# EAGLE design 9KeyRGB (EAGLE 8.6.1)
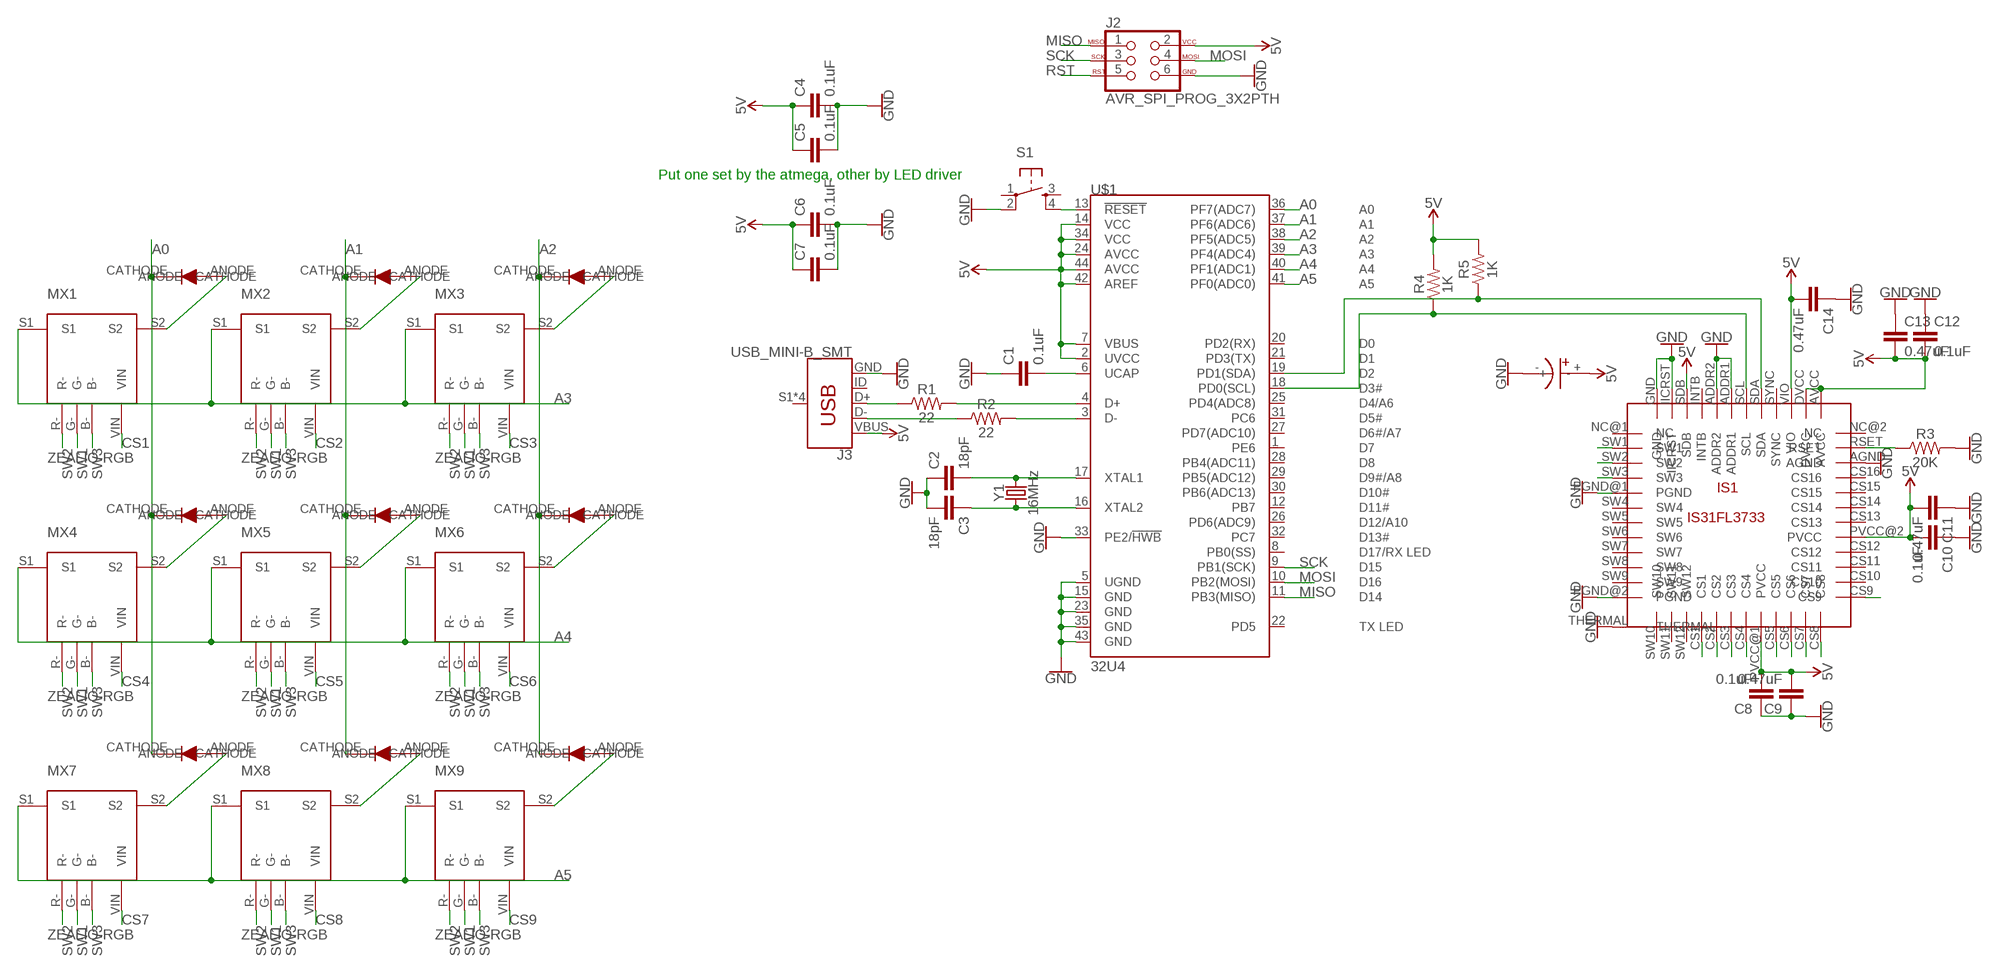
[diagram p0: schematic, sheet 1]

## Parts
C1  0.1uF  0.1UF-0603-25V-5%  [0603]
C2  18pF  0.18UF-0603-10V-10%  [0603]
C3  18pF  0.18UF-0603-10V-10%  [0603]
C4  0.1uF  0.1UF-0603-25V-5%  [0603]
C5  0.1uF  0.1UF-0603-25V-5%  [0603]
C6  0.1uF  0.1UF-0603-25V-5%  [0603]
C7  0.1uF  0.1UF-0603-25V-5%  [0603]
C8  0.1uF  0.1UF-0603-25V-5%  [0603]
C9  0.47uF  0.1UF-0603-25V-5%  [0603]
C10  0.1uF  0.1UF-0603-25V-5%  [0603]
C11  0.47uF  0.1UF-0603-25V-5%  [0603]
C12  0.1uF  0.1UF-0603-25V-5%  [0603]
C13  0.47uF  0.1UF-0603-25V-5%  [0603]
C14  0.47uF  0.1UF-0603-25V-5%  [0603]
D1  BAS16L  [BAS16L]
D2  BAS16L  [BAS16L]
D3  BAS16L  [BAS16L]
D4  BAS16L  [BAS16L]
D5  BAS16L  [BAS16L]
D6  BAS16L  [BAS16L]
D7  BAS16L  [BAS16L]
D8  BAS16L  [BAS16L]
D9  BAS16L  [BAS16L]
IS1  IS31FL3733  [IS31FL3733]
J2  AVR_SPI_PROG_3X2PTH  [2X3]
J3  USB_MINI-B_SMT  [USB-MINIB]
MX1  ZEALIO-RGB  [ZEALIO-RGB]
MX2  ZEALIO-RGB  [ZEALIO-RGB]
MX3  ZEALIO-RGB  [ZEALIO-RGB]
MX4  ZEALIO-RGB  [ZEALIO-RGB]
MX5  ZEALIO-RGB  [ZEALIO-RGB]
MX6  ZEALIO-RGB  [ZEALIO-RGB]
MX7  ZEALIO-RGB  [ZEALIO-RGB]
MX8  ZEALIO-RGB  [ZEALIO-RGB]
MX9  ZEALIO-RGB  [ZEALIO-RGB]
R1  22  0.05OHM-0603-1/5W-1%  [0603]
R2  22  0.05OHM-0603-1/5W-1%  [0603]
R3  20K  0.05OHM-0603-1/5W-1%  [0603]
R4  1K  0.05OHM-0603-1/5W-1%  [0603]
R5  1K  0.05OHM-0603-1/5W-1%  [0603]
S1  TAC_SWITCHPTH  [TACTILE-PTH]
U$1  32U4  ATMEGA32U4TQFP-44  [TQFP44]
U$2  EEA-FC1A220  [EEA-FC1A220]
Y1  16MHz  CRYSTAL-16MHZPTH-HC49US  [HC49US]

## Nets
5V: C4.1 C5.1 C6.1 C7.1 C8.2 C9.2 C10.2 C11.2 C12.2 C13.2 C14.2 IS1.AVCC IS1.DVCC IS1.PVCC@1(PVCC) IS1.PVCC@2(PVCC) IS1.SDB IS1.VIO J2.2 J3.VBUS R4.2 R5.2 U$1.2(UVCC) U$1.7(VBUS) U$1.14(VCC) U$1.24(AVCC) U$1.34(VCC) U$1.42(AREF) U$1.44(AVCC) U$2.+
A0: D1.CATHODE D4.CATHODE D7.CATHODE U$1.36(PF7(ADC7))
A1: D2.CATHODE D5.CATHODE D8.CATHODE U$1.37(PF6(ADC6))
A2: D3.CATHODE D6.CATHODE D9.CATHODE U$1.38(PF5(ADC5))
A3: MX1.S1 MX2.S1 MX3.S1 U$1.39(PF4(ADC4))
A4: MX4.S1 MX5.S1 MX6.S1 U$1.40(PF1(ADC1))
A5: MX7.S1 MX8.S1 MX9.S1 U$1.41(PF0(ADC0))
CS1: IS1.CS1 MX1.VIN
CS2: IS1.CS2 MX2.VIN
CS3: IS1.CS3 MX3.VIN
CS4: IS1.CS4 MX4.VIN
CS5: IS1.CS5 MX5.VIN
CS6: IS1.CS6 MX6.VIN
CS7: IS1.CS7 MX7.VIN
CS8: IS1.CS8 MX8.VIN
CS9: IS1.CS9 MX9.VIN
GND: C1.1 C2.1 C3.2 C4.2 C5.2 C6.2 C7.2 C8.1 C9.1 C10.1 C11.1 C12.1 C13.1 C14.1 IS1.ADDR1 IS1.ADDR2 IS1.AGND IS1.GND IS1.IICRST IS1.PGND@1(PGND) IS1.PGND@2(PGND) IS1.THERMAL J2.6 J3.GND R3.2 S1.2 U$1.5(UGND) U$1.15(GND) U$1.23(GND) U$1.33(PE2/!HWB) U$1.35(GND) U$1.43(GND) U$2.-
MISO: J2.1 U$1.11(PB3(MISO))
MOSI: J2.4 U$1.10(PB2(MOSI))
N$1: D1.ANODE MX1.S2
N$2: D2.ANODE MX2.S2
N$3: D3.ANODE MX3.S2
N$4: D4.ANODE MX4.S2
N$5: D5.ANODE MX5.S2
N$6: D6.ANODE MX6.S2
N$7: D7.ANODE MX7.S2
N$8: D8.ANODE MX8.S2
N$9: D9.ANODE MX9.S2
N$16: IS1.SDA R5.1 U$1.19(PD1(SDA))
N$17: C1.2 U$1.6(UCAP)
N$18: J3.D+ R1.1
N$19: R1.2 U$1.4(D+)
N$20: J3.D- R2.1
N$21: R2.2 U$1.3(D-)
N$22: C2.2 U$1.17(XTAL1) Y1.2
N$23: C3.1 U$1.16(XTAL2) Y1.1
N$24: IS1.SCL R4.1 U$1.18(PD0(SCL))
N$27: IS1.RSET R3.1
RST: J2.5 S1.4 U$1.13(!RESET)
SCK: J2.3 U$1.9(PB1(SCK))
SW1: IS1.SW1 MX1.G- MX2.G- MX3.G- MX4.G- MX5.G- MX6.G- MX7.G- MX8.G- MX9.G-
SW2: IS1.SW2 MX1.R- MX2.R- MX3.R- MX4.R- MX5.R- MX6.R- MX7.R- MX8.R- MX9.R-
SW3: IS1.SW3 MX1.B- MX2.B- MX3.B- MX4.B- MX5.B- MX6.B- MX7.B- MX8.B- MX9.B-
Unconnected: IS1.CS10 IS1.CS11 IS1.CS12 IS1.CS13 IS1.CS14 IS1.CS15 IS1.CS16 IS1.INTB IS1.NC@1(NC) IS1.NC@2(NC) IS1.SW4 IS1.SW5 IS1.SW6 IS1.SW7 IS1.SW8 IS1.SW9 IS1.SW10 IS1.SW11 IS1.SW12 IS1.SYNC J3.ID J3.S1(SHIELD) J3.S2(SHIELD) J3.S3(SHIELD) J3.S4(SHIELD) S1.1 S1.3 U$1.1(PE6) U$1.8(PB0(SS)) U$1.12(PB7) U$1.20(PD2(RX)) U$1.21(PD3(TX)) U$1.22(PD5) U$1.25(PD4(ADC8)) U$1.26(PD6(ADC9)) U$1.27(PD7(ADC10)) U$1.28(PB4(ADC11)) U$1.29(PB5(ADC12)) U$1.30(PB6(ADC13)) U$1.31(PC6) U$1.32(PC7)

## Notes on the sheet
- Put one set by the atmega, other by LED driver

## Library data of the parts
C1 C4-C8 C10 C12 = SparkFun-Capacitors:0.1UF: 0.1µF ceramic capacitors A capacitor is a passive two-terminal electrical component used to store electrical energy temporarily in an electric field.; PROD_ID: CAP-08604
C2 C3 = SparkFun-Capacitors:0.18UF: 0.18µF ceramic capacitor A capacitor is a passive two-terminal electrical component used to store electrical energy temporarily in an electric field.; PROD_ID: CAP-12380; VALUE: 0.18uF
C9 C11 C13 C14 = SparkFun-Capacitors:0.1UF: 0.1µF ceramic capacitors A capacitor is a passive two-terminal electrical component used to store electrical energy temporarily in an electric field.; PROD_ID: CAP-08604; VALUE: 0.1uF
D1-D9 = Ben's Parts:BAS16L
IS1 = Ben's Parts:IS31FL3733
J2 = SparkFun-Connectors:AVR_SPI_PROG_3X2: AVR ISP 6 Pin This is the reduced ISP connector for AVR programming. Common on Arduino. This footprint will take up less PCB space and can be used with a 10-pin to 6-pin adapter such as SKU: BOB-08508 **Special note about "TEST_POINT" package. The stop mask is on the top side, so if you want your programming test points to be on the bottom of your board, make sure to place this package on the bottom side of the board. This also ensure that the orientation to program from the bottom side will be correct. SparkFun Products: SparkFun ISP Pogo Adapter <https://www.sparkfun.com/products/11591> - NS Tiny AVR Programmer <https://www.sparkfun.com/products/11801> -PTH
J3 = SparkFun-Connectors:USB_MINI-B: USB type Mini-B Connector Breaks out 5th pin, and includes shield pins if needed. SparkFun Products: SparkFun FTDI Basic Breakout <https://www.sparkfun.com/products/9716> SparkFun XBee Explorer USB <https://www.sparkfun.com/products/11812> SparkFun Redboard <https://www.sparkfun.com/products/12757>; PROD_ID: CONN-08193; SF_ID: PRT-00587
MX1-MX9 = Ben's Parts:ZEALIO-RGB
R1-R5 = SparkFun-Resistors:0.05OHM: 0.05Ω resistor A resistor is a passive two-terminal electrical component that implements electrical resistance as a circuit element. Resistors act to reduce current flow, and, at the same time, act to lower voltage levels within circuits. - Wikipedia; PROD_ID: RES-12535; VALUE: 0.05
S1 = SparkFun-Retired:TAC_SWITCH: Momentary Switch Button commonly used for reset or general input. Spark Fun Electronics SKU : COM-00097 SMT- SWCH-08247
U$1 = SparkFun-IC-Microcontroller:ATMEGA32U4: Atmel MCU, 32KByte Atmel 44-pin 8-bit Microcontroller with 32KBytes of ISP Flash and USB Controller Datasheet <http://cdn.sparkfun.com/datasheets/Dev/Arduino/Boards/ATMega32U4.pdf> SparkFun Products LilyPad Arduino USB - ATmega32U4 Board <https://www.sparkfun.com/products/12049> (DEV-12049) Pro Micro - 5V/16MHz <https://www.sparkfun.com/products/12640> (DEV-12640) Pro Micro - 3.3V/8MHz <https://www.sparkfun.com/products/12587> (DEV-12587) Fio v3 - ATmega32U4 <https://www.sparkfun.com/products/11520> (DEV-11520) Qduino Mini <https://www.sparkfun.com/products/13614> (DEV-13614) Makey Makey - Standard Kit <https://www.sparkfun.com/products/11511> (WIG-11511) Makey Makey Deluxe Kit <https://www.sparkfun.com/products/11519> (WIG-11519); PROD_ID: IC-11161
U$2 = Ben's Parts:EEA-FC1A220
Y1 = SparkFun-Clocks:CRYSTAL-16MHZ: 16MHz Crystal Digikey Example <http://www.digikey.com/product-search/en?keywords=535-9122-1-ND> Frequency: 16MHz Frequency Stability: ±50ppm Frequency Tolerance: ±20ppm Load Capacitance: 18pF SparkFun Products: Pro Micro -5V/16MHz <https://www.sparkfun.com/products/12640> SparkFun Serial Enabled LCD Kit <https://www.sparkfun.com/products/10097>; PROD_ID: XTAL-08181; SF_ID: COM-00536

## Board
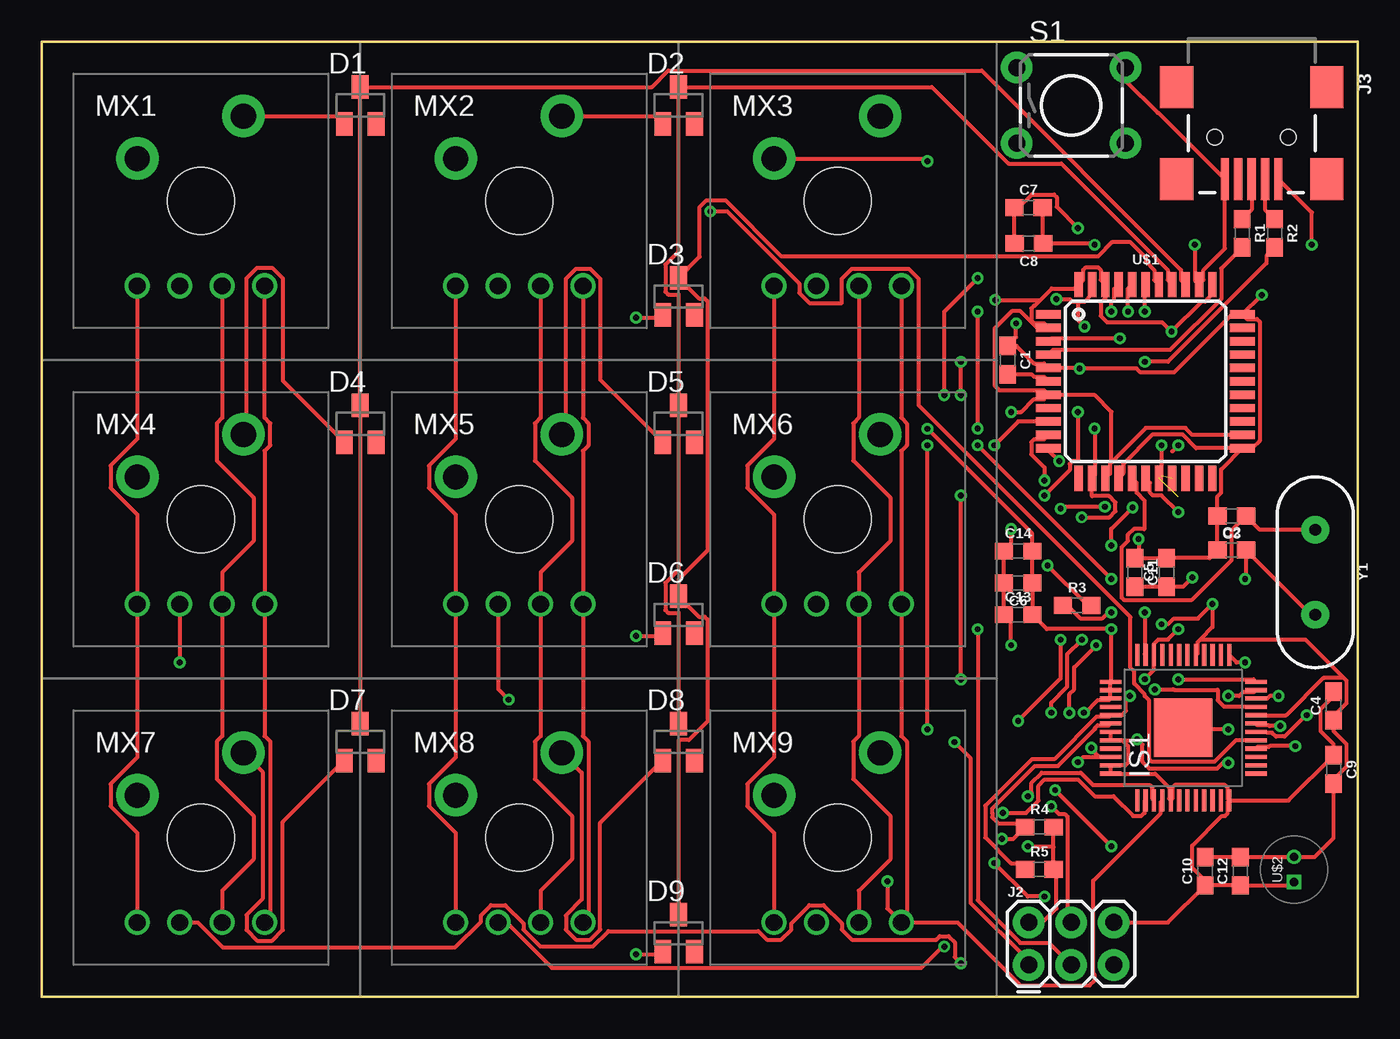
[diagram p1: board, top side]
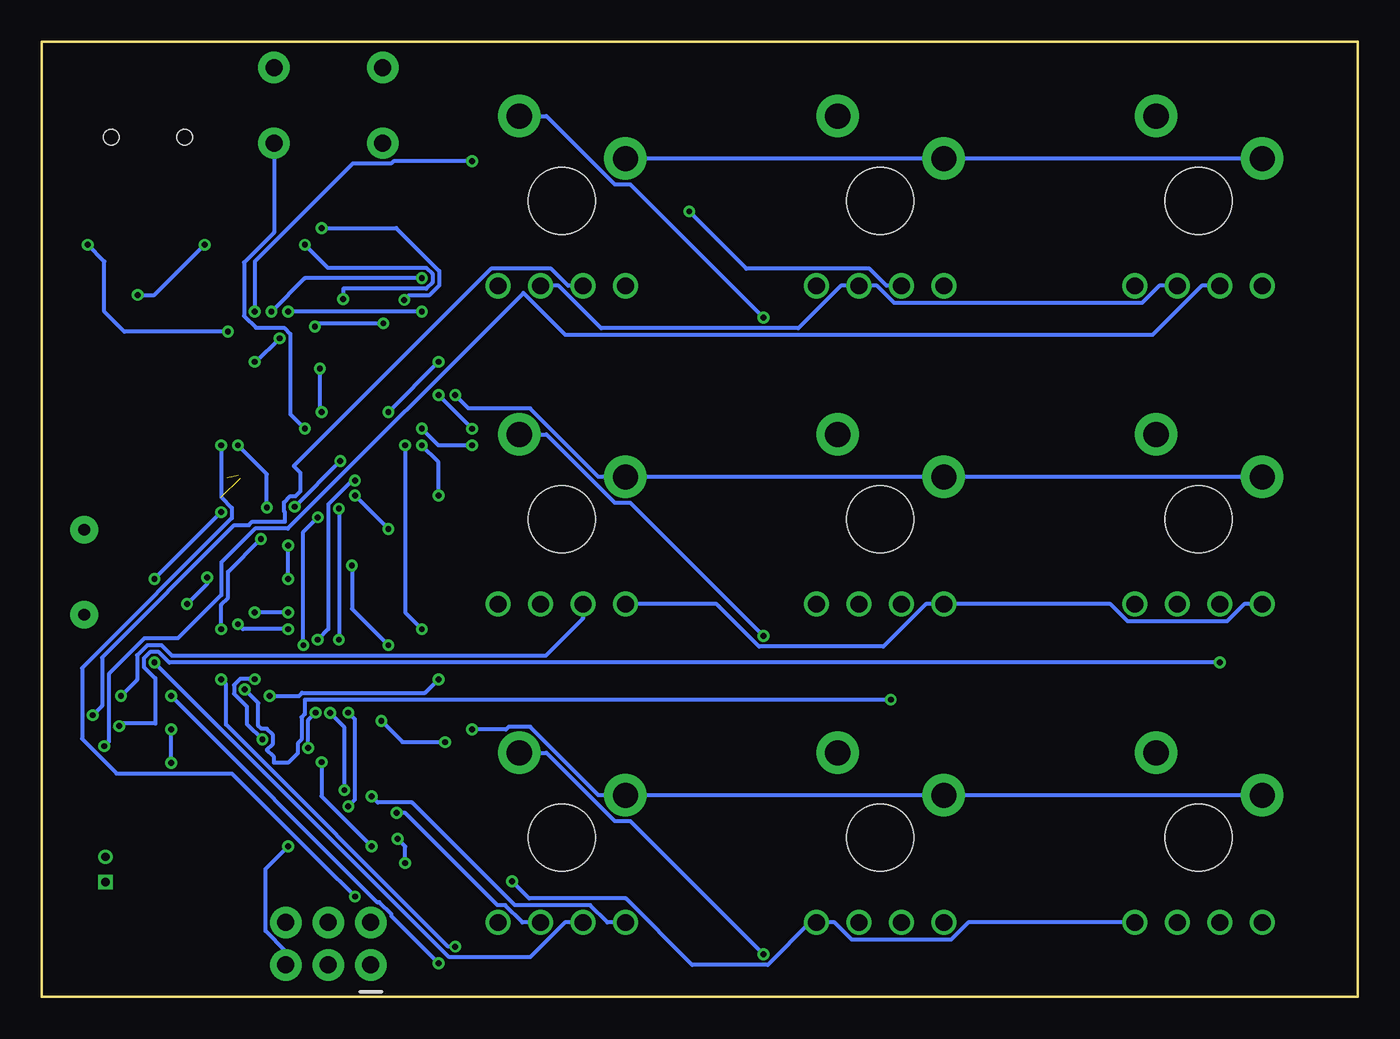
[diagram p2: board, bottom side, seen from below]

Size 78.74 x 57.15 mm. Coordinates in mm from the lower left corner, seen from the top.
Outline: 0,57.15 78.74,57.15 78.74,0 0,0 0,57.15
Copper layers (1*16): Top 0.0356mm / dielectric 1.5011mm / Bottom 0.0356mm
Design rules "oshpark-2layer *": minimum track width 6mil, minimum drill 13mil, track to track 6mil, track to pad 6mil, pad to pad 6mil, via to via 6mil, smd to smd 6mil, copper to edge 15mil, drill to drill 6mil, minimum pad ring 7mil, minimum via ring 7mil, stop-mask expansion 2.5mil, vias tented up to drill 1mm, thermal gap 10mil

### Footprints (pad centres in the part's own frame; a part is rotated, then mirrored left to right if it is on the bottom)
0603 = smd 1.1 x 1: 1 -0.85,0; 2 0.85,0
BAS16L = smd 1 x 1.4: ANODE 0.955,2.075; CATHODE 1.905,4.275; NC 2.855,2.075
IS31FL3733 = smd 0.25 x 1.3: ADDR1 -0.25,4.35; ADDR2 -0.75,4.35; AVCC 2.75,4.35; CS1 -1.25,-4.35; CS2 -0.75,-4.35; CS3 -0.25,-4.35; CS4 0.25,-4.35; CS5 1.25,-4.35; CS6 1.75,-4.35; CS7 2.25,-4.35; CS8 2.75,-4.35; DVCC 2.25,4.35; GND -2.75,4.35; IICRST -2.25,4.35; INTB -1.25,4.35; PVCC@1 0.75,-4.35; SCL 0.25,4.35; SDA 0.75,4.35; SDB -1.75,4.35; SW10 -2.75,-4.35; SW11 -2.25,-4.35; SW12 -1.75,-4.35; SYNC 1.25,4.35; VIO 1.75,4.35 | smd 1.3 x 0.25: AGND 4.35,1.75; CS9 4.35,-2.75; CS10 4.35,-2.25; CS11 4.35,-1.75; CS12 4.35,-1.25; CS13 4.35,-0.25; CS14 4.35,0.25; CS15 4.35,0.75; CS16 4.35,1.25; NC@1 -4.35,2.75; NC@2 4.35,2.75; PGND@1 -4.35,0.75; PGND@2 -4.35,-2.75; PVCC@2 4.35,-0.75; RSET 4.35,2.25; SW1 -4.35,2.25; SW2 -4.35,1.75; SW3 -4.35,1.25; SW4 -4.35,0.25; SW5 -4.35,-0.25; SW6 -4.35,-0.75; SW7 -4.35,-1.25; SW8 -4.35,-1.75; SW9 -4.35,-2.25 | smd 3.5 x 3.5: THERMAL 0,0
2X3 = drill 1.016 pad 1.88: 1 0,0; 2 0,2.54; 3 2.54,0; 4 2.54,2.54; 5 5.08,0; 6 5.08,2.54
USB-MINIB = smd 2.5 x 0.5: D+ 2.5,0; D- 2.5,0.8; GND 2.5,-1.6; ID 2.5,-0.8; VBUS 2.5,1.6 | smd 2.5 x 2: S1 -3,4.5; S2 2.5,4.5; S3 -3,-4.5; S4 2.5,-4.5 | hole 0.9: 0,2.2; 0,-2.2
ZEALIO-RGB = drill 1: B- 3.81,-5.08; G- 1.27,-5.08; R- -3.81,-5.08; VIN -1.27,-5.08 | drill 1.5 pad 2.54: S1 -3.81,2.54; S2 2.54,5.08 | hole 4: 0,0
TACTILE-PTH = drill 1.016 pad 1.88: 1 -3.251,2.261; 2 3.251,2.261; 3 -3.251,-2.261; 4 3.251,-2.261
TQFP44 = smd 1.5 x 0.5: 1 -5.8,4; 2 -5.8,3.2; 3 -5.8,2.4; 4 -5.8,1.6; 5 -5.8,0.8; 6 -5.8,0; 7 -5.8,-0.8; 8 -5.8,-1.6; 9 -5.8,-2.4; 10 -5.8,-3.2; 11 -5.8,-4; 23 5.8,-4; 24 5.8,-3.2; 25 5.8,-2.4; 26 5.8,-1.6; 27 5.8,-0.8; 28 5.8,0; 29 5.8,0.8; 30 5.8,1.6; 31 5.8,2.4; 32 5.8,3.2; 33 5.8,4 | smd 0.5 x 1.5: 12 -4,-5.8; 13 -3.2,-5.8; 14 -2.4,-5.8; 15 -1.6,-5.8; 16 -0.8,-5.8; 17 0,-5.8; 18 0.8,-5.8; 19 1.6,-5.8; 20 2.4,-5.8; 21 3.2,-5.8; 22 4,-5.8; 34 4,5.8; 35 3.2,5.8; 36 2.4,5.8; 37 1.6,5.8; 38 0.8,5.8; 39 0,5.8; 40 -0.8,5.8; 41 -1.6,5.8; 42 -2.4,5.8; 43 -3.2,5.8; 44 -4,5.8
EEA-FC1A220 = drill 0.5: + 0.75,0 | drill 0.5 square: - -0.75,0
HC49US = drill 0.7 pad 1.651: 1 -2.54,0; 2 2.54,0

### Placement (x,y rotation side)
C1  57.78,38.1 270 top
C2  71.2,26.73 0 top
C3  71.2,28.77 180 top
C4  77.3,17.4 90 top
C5  67.31,25.4 90 top
C6  58.42,24.77 180 top
C7  59.05,47.23 0 top
C8  59.05,45.09 180 top
C9  77.3,13.6 270 top
C10  69.61,7.52 90 top
C11  65.41,25.4 270 top
C12  71.72,7.52 90 top
C13  58.42,22.86 0 top
C14  58.42,26.67 0 top
D1  17.14,50.16 0 top
D2  36.2,50.16 0 top
D3  36.2,38.73 0 top
D4  17.14,31.11 0 top
D5  36.2,31.11 0 top
D6  36.2,19.68 0 top
D7  17.14,12.06 0 top
D8  36.2,12.06 0 top
D9  36.2,0.64 0 top
IS1  68.3,16.1 90 top
J2  59.05,1.91 0 top
J3  72.39,51.44 270 top
MX1  9.53,47.62 0 top
MX2  28.57,47.62 0 top
MX3  47.62,47.62 0 top
MX4  9.53,28.57 0 top
MX5  28.57,28.57 0 top
MX6  47.62,28.57 0 top
MX7  9.53,9.53 0 top
MX8  28.57,9.53 0 top
MX9  47.62,9.53 0 top
R1  71.83,45.69 270 top
R2  73.77,45.69 270 top
R3  61.95,23.42 0 top
R4  59.69,10.16 0 top
R5  59.69,7.62 0 top
S1  61.59,53.34 0 top
U$1  66.04,36.83 0 top
U$2  74.93,7.62 90 top
Y1  76.2,25.4 270 top

### Tracks (layer width: path | path; a pad name or v marks a point on that pad's centre or on a via)
5V  (via drill 0.35)
  Top 0.254: C10.2 C12.2 U$2.+ 76.17,8.37 77.3,9.5 C9.2 77.3,13.01 78.08,13.78 78.08,15.12 77.3,15.89 C4.1 77.3,16.8 78.08,17.58 78.08,18.92 77.92,19.08 | 60.54,8.96 R5.2 60.71,7.45 60.71,5.29 59.87,4.45 J2.2 | 60.54,8.96 R4.2 | 77.92,19.08 76.68,19.08 74.45,16.85 IS1.PVCC@1 | C8.2 C7.1 58.45,47.23 59.23,48 60.56,48 60.72,47.84 60.72,47.28 v62,46 | v57.05,41.7 59.76,41.7 | 59.76,41.7 60.44,42.38 61.79,42.38 U$1.44 62.31,42.9 62.31,43.5 62.47,43.66 63.21,43.66 63.37,43.5 63.37,42.9 U$1.42 63.64,41.81 63.37,41.54 63.37,40.74 63.74,40.37 67.03,40.37 v67.6,39.8 69.4,41.6 69.61,41.6 70.04,42.03 U$1.34 | v76,45 76,46.92 J3.VBUS | 59.76,41.7 59.41,41.36 59.37,41.36 59.21,41.2 59.21,40.46 59.37,40.3 59.97,40.3 U$1.2 59.56,40.03 58.56,41.03 58.04,41.03 57.01,40 57.01,36.58 57.29,36.3 59.97,36.3 U$1.7 | 69.31,21.38 75.62,21.38 77.92,19.08 | U$1.7 62.97,36.03 64,35 64,31.98 | 64,31.98 63.91,31.9 63.91,31.3 U$1.14 | U$1.24 68.84,33.63 68.43,34.04 66.05,34.04 64,31.98 | C11.2 C5.1 68.3,24.55 v68.85,25.1 | v62,14.04 62.31,14.35 IS1.SDB 63.28,14.35 63.02,14.61 63.02,14.68 v62.8,14.9 | v59,9 60.5,9 60.54,8.96 | v62.35,17 62.43,17 63.18,17.75 63.85,17.75 IS1.VIO IS1.DVCC IS1.AVCC 64,18.9 v64,22 60.13,22 C13.2 C6.1 C14.2 59.27,27.71 v52.99,33.99 | 69.31,21.38 69.15,21.22 69.15,20.55 IS1.PVCC@2 | 69.31,21.38 70.05,22.12 v70.05,23.5 69.18,22.63 67.74,22.63 67.41,22.3 v67,22.3 | v55,36 v55,38 | U$1.7 59.97,35.76 59.37,35.76 58.62,35 v58,35 | v55,36 v55,38 | v55,36 v55,38
  Bottom 0.254: v57.05,41.7 56.79,41.96 55.57,41.96 54.96,42.57 54.96,43.43 57.53,46 v62,46 | v76,45 75,44 75,41 73.8,39.8 v67.6,39.8 | v68.85,25.1 68.85,24.7 v70.05,23.5 | v62,14.04 62,12 v59,9 | v62.8,14.9 62.8,16.56 v62.35,17 | v52.99,33.99 v55,36 | v55,38 v58,35 | v64,22 66.7,22 v67,22.3
A0
  Top 0.254: D7.CATHODE D4.CATHODE D1.CATHODE 36.51,54.44 37.48,55.42 56.25,55.42 68.17,43.5 68.17,42.9 U$1.36
A1
  Top 0.254: D8.CATHODE 38.1,22.98 37.48,22.98 37.32,23.14 37.32,24.78 38.1,25.55 D5.CATHODE 38.1,42.03 37.48,42.03 37.32,42.19 37.32,43.83 38.1,44.6 D2.CATHODE 53.26,54.44 57.84,49.86 61.01,49.86 67.37,43.5 67.37,42.9 U$1.37
A2
  Top 0.254: D9.CATHODE 38.1,15.36 38.72,15.36 39.83,16.47 39.83,22.58 39.67,22.74 39.32,22.74 D6.CATHODE 38.1,24.98 39.83,26.71 39.83,41.63 39.67,41.79 39.32,41.79 D3.CATHODE 39.37,44.28 39.37,47.26 39.74,47.63 40.94,47.63 44.27,44.31 44.92,44.31 45,44.31 63.2,44.31 64.04,45.15 65.14,45.15 66.08,44.21 66.08,43.98 66.57,43.5 66.57,42.9 U$1.38
A3  (via drill 0.35)
  Top 0.254: MX3.S1 52.84,50.16 v53,50 | v66,41 66,42.59 U$1.39
  Bottom 0.254: MX1.S1 MX2.S1 MX3.S1 | v53,50 57.7,50 57.84,49.86 60.14,49.86 66,44 v66,41
A4  (via drill 0.35)
  Top 0.254: v54,36 54,41 v56,43 | v65,41 65,42.39 U$1.40
  Bottom 0.254: MX4.S1 MX5.S1 MX6.S1 45.43,31.11 49.52,35.2 53.2,35.2 v54,36 | v56,43 63,43 v65,41
A5  (via drill 0.35)
  Top 0.254: v53,16 v53,33 | v56,34 v56,41 | U$1.41 64.17,42.36 64.17,41.76 64,41.59 v64,41
  Bottom 0.254: MX7.S1 MX8.S1 MX9.S1 45.43,12.06 49.52,16.15 50.81,16.15 50.96,16 v53,16 | v53,33 55,33 v56,34 | v56,41 v64,41
CS1  (via drill 0.35)
  Top 0.254: v75,15 73.47,15 73.42,14.95 72.75,14.95 IS1.CS1
  Bottom 0.254: v75,15 74.73,15.27 74.73,19.31 72.6,21.45 70.6,21.45 68,24.04 68,26 65.98,28.02 64.02,28.02 49.92,42.12 47.41,39.6 12.28,39.6 9.34,42.55 MX1.VIN
CS2  (via drill 0.35)
  Top 0.254: v40,47 41,47 45.33,42.67 45.33,42.12 45.93,41.52 47.87,41.52 47.87,42.97 48.47,43.57 51.86,43.57 52.46,42.97 52.46,35.41 65.15,22.73 65.15,19.68 65.36,19.47 65.36,19 | IS1.CS2 71.45,15.35 70.17,14.07 66.43,14.07 66.27,14.23 66.27,17.73 66,18 66,18.11 65.36,18.75 65.36,19 | 65.36,19 65.36,19.27
  Bottom 0.254: MX2.VIN 28.19,42.55 29.21,43.57 36.57,43.57 v40,47
CS3  (via drill 0.35)
  Top 0.254: v75.7,16.85 75.64,16.85 74.36,15.57 73.84,15.57 73.61,15.79 73.3,15.79 73.25,15.85 IS1.CS3
  Bottom 0.254: MX3.VIN 47.24,42.55 48.27,43.57 51.86,43.57 63.67,31.77 63.26,31.35 63.26,30.26 63.56,29.96 63.88,29.96 64.25,29.59 64.25,29.06 64.19,29.01 64.19,28.43 66.15,28.43 66.36,28.22 67.22,28.22 75.14,20.3 75.14,17.41 v75.7,16.85
CS4  (via drill 0.35)
  Top 0.254: MX4.VIN v8.26,20 v8.25,20 | v74.1,16.2 73.47,16.2 73.42,16.25 72.75,16.25 IS1.CS4
  Bottom 0.254: v8.25,20 71.11,20 71.74,20.63 72.26,20.63 72.63,20.26 72.63,19.74 71.95,19.06 71.95,16.35 73.95,16.35 v74.1,16.2
CS5  (via drill 0.35)
  Top 0.254: MX5.VIN 27.3,18.41 v27.94,17.78 | IS1.CS5 72.63,17.37 70.74,17.37 70.37,17.74 70.37,18.37 67.74,18.37 67.71,18.4 v66.6,18.4
  Bottom 0.254: v27.94,17.78 63,17.78 63,16.93 63.2,16.73 63.2,15.39 63.43,15.16 63.43,14.57 64,14 64.85,14 64.85,14.34 65.28,14.77 64.91,15.14 64.91,15.66 65.28,16.03 65.6,16.03 65.78,16.22 65.78,17.58 v66.6,18.4
CS6  (via drill 0.35)
  Top 0.254: v74,18 73.47,18 73.32,17.85 IS1.CS6
  Bottom 0.254: MX6.VIN 46.35,22.64 48.59,20.41 70.94,20.41 71.57,21.04 72.43,21.04 73.04,20.43 73.04,18.96 v74,18
CS7  (via drill 0.35)
  Top 0.254: MX7.VIN 9.34,4.45 10.83,2.95 24.73,2.95 26.28,4.5 26.28,4.87 26.88,5.47 27.73,5.47 28.82,4.39 28.82,4.02 29.82,3.01 32.98,3.01 33.9,3.93 42.87,3.93 43.39,3.42 44.24,3.42 44.84,4.02 44.84,4.39 45.93,5.47 46.78,5.47 47.87,4.39 47.87,4.02 48.47,3.42 53.52,3.42 53.74,3.63 54.26,3.63 54.63,3.26 54.63,2.37 v55,2 | IS1.CS7 72.55,18.25 71.88,18.25 71.63,18 v71,18
  Bottom 0.254: v71,18 58.66,5.66 58.55,5.66 57.84,4.95 57.84,4.84 v55,2
CS8  (via drill 0.35)
  Top 0.254: MX8.VIN 27.81,4.45 30.53,1.73 52.62,1.73 53.89,3 v54,3 | v68,19 72.5,19 IS1.CS8
  Bottom 0.254: v68,19 67.71,18.71 67.71,16.29 54.42,3 v54,3
CS9  (via drill 0.35)
  Top 0.254: v72,20 71.5,20 IS1.CS9
  Bottom 0.254: MX9.VIN 47.44,4.45 49.52,2.37 54.37,2.37 v72,20
GND  (via drill 0.35)
  Top 0.254: C10.1 C12.1 74.73,6.67 U$2.- | J2.6 67.39,4.45 C10.1 | C4.2 77.3,18 76.52,17.22 76.52,15.88 77.3,15.11 C9.1 74.6,11.75 IS1.PGND@2 | IS1.PGND@2 70.95,11.65 70.95,10.98 70.79,10.82 70.61,10.82 68.83,9.04 68.83,7.7 69.61,6.92 C10.1 | IS1.PGND@2 70.95,11.85 70.95,12.52 70.79,12.68 67.81,12.68 67.65,12.52 67.65,11.85 IS1.PGND@1 67.46,11.84 67.46,12.51 66.62,13.35 IS1.GND IS1.IICRST 64.85,13.85 65,14 65,15 64.65,15.35 IS1.ADDR2 | C7.2 59.9,45.09 C8.1 62.91,45.09 v63,45 | v60.7,41.75 61.52,41.75 61.67,41.6 62,41.6 | 62,41.6 62.41,41.6 62.84,42.03 U$1.43 | S1.2 64.85,54.83 66.77,52.91 66.82,52.91 J3.GND 70.79,44.77 69.51,43.5 69.51,42.9 U$1.35 69,42.87 v69,45 | U$1.23 70.57,31.56 70.57,30.16 70.35,29.95 C3.2 C2.1 69.86,26.25 C5.2 C11.1 65.63,26.48 v65.63,27.39 | 62,41.6 62,40.5 v62.4,40.1 | v58.3,40.3 58.3,39.47 C1.1 58.33,38.95 59.37,37.9 59.97,37.9 U$1.5 62.07,37.63 v62.1,37.6 65.51,37.6 65.74,37.37 67.74,37.37 71.2,40.83 U$1.33 | U$1.15 64.71,31.3 64.71,31.9 66.45,33.63 68.26,33.63 69.06,32.83 U$1.23 | U$1.33 72.11,40.56 72.71,40.56 72.87,40.4 72.87,33.26 72.44,32.83 U$1.23 | U$1.33 v73,42 | v58,28 58,27.1 C14.1 C6.2 C13.1 58,22.43 v58,21.04 | v60,30 61.51,31.51 61.51,31.9 61.67,32.06 62,32.06 v62,35 | IS1.ADDR1 IS1.ADDR2 | v65.99,19.01 66.55,19.56 IS1.AGND 66.55,21.12 66.81,21.38 67.38,21.38 v68,22 | R3.2 62.58,23.42 v60.18,25.82 | 65.86,14.07 66.27,13.66 | 66.27,13.66 70.33,13.66 70.67,14 v71,14 | v71,16 68.4,16 IS1.THERMAL | 66.27,13.66 65.86,14.07 | 65.86,14.07 65.86,15.07 v65.54,15.4 65.49,15.35 IS1.ADDR2
  Bottom 0.254: v63,45 61.63,43.63 55.74,43.63 55.37,43.26 55.37,42.74 55.74,42.37 60.7,42.37 v60.7,41.75 | v62.1,37.6 62.1,35.1 v62,35 | v58.3,40.3 62.2,40.3 v62.4,40.1 | v73,42 72,42 v69,45 | v60,30 v58,28 | v65.99,19.01 66.31,19.01 66.34,19.03 66.86,19.03 67.23,18.66 67.23,18.14 66.47,17.37 66.47,16.33 v65.54,15.4 | v60.18,25.82 60.18,23.22 v58,21.04 | v68,22 68,23.47 67.59,23.88 67.59,25.43 v65.63,27.39 | v71,14 v71,16
MISO  (via drill 0.35)
  Top 0.254: J2.1 59.05,2.15 55.59,5.61 55.59,14.26 v54.61,15.24 | U$1.11 60.24,32.7 v60.88,32.06 | v63.61,29.32 61.07,29.32 v60.96,29.21 | v60.96,21.37 60.96,19.05 v58.42,16.51
  Bottom 0.254: v60.88,32.06 v63.61,29.32 | v60.96,29.21 v60.96,21.37 | v54.61,15.24 57.15,15.24 v58.42,16.51
MOSI  (via drill 0.35)
  Top 0.254: U$1.10 59.97,33.36 59.37,33.36 59.21,33.2 59.21,32.46 60,31.68 v60,30.89 | v60.4,11.4 60.86,10.94 61.21,10.94 61.37,10.78 61.37,4.67 J2.4 | v62.23,21.37 61.37,20.5 61.37,18.56 60.4,17.6 v60.4,17
  Bottom 0.254: v62.23,21.37 61.59,22.01 61.59,29.47 60.09,30.98 v60,30.89 | v60.4,11.4 60,11.8 60,16.6 v60.4,17
N$1
  Top 0.254: MX1.S2 17.64,52.7 D1.ANODE
N$2
  Top 0.254: MX2.S2 36.69,52.7 D2.ANODE
N$3  (via drill 0.35)
  Top 0.254: v35.56,40.64 36.98,40.64 D3.ANODE
  Bottom 0.254: v35.56,40.64 43.54,48.62 44.46,48.62 48.55,52.7 MX3.S2
N$4
  Top 0.254: MX4.S2 12.25,33.84 12.25,42.99 12.89,43.63 13.78,43.63 14.42,42.99 14.42,36.87 D4.ANODE
N$5
  Top 0.254: MX5.S2 31.36,33.9 31.36,42.97 31.96,43.57 32.81,43.57 33.41,42.97 33.41,36.93 D5.ANODE
N$6  (via drill 0.35)
  Top 0.254: v35.56,21.59 36.98,21.59 D6.ANODE
  Bottom 0.254: v35.56,21.59 43.54,29.57 44.46,29.57 48.55,33.66 MX6.S2
N$7
  Top 0.254: MX7.S2 13.21,13.46 13.21,5.85 12.25,4.89 12.25,4 12.89,3.36 13.78,3.36 14.42,4 14.42,10.46 D7.ANODE
N$8
  Top 0.254: MX8.S2 32.31,13.41 32.31,5.83 31.36,4.87 31.36,4.02 31.96,3.42 32.81,3.42 33.41,4.02 33.41,10.4 D8.ANODE
N$9  (via drill 0.35)
  Top 0.254: v35.56,2.54 36.98,2.54 D9.ANODE
  Bottom 0.254: v35.56,2.54 43.54,10.52 44.46,10.52 48.55,14.61 MX9.S2
N$16  (via drill 0.35)  (1 unrouted)
  Top 0.254: v65.11,18 64.88,17.77 64.88,17.11 64.62,16.85 IS1.SDA 63.86,16.76 63.11,16.76 60.57,14.22 59.25,14.22 56.46,11.43 56.46,9.54 58,8 58.46,8 R5.1 | v55,19 v55,30 | v56,33 v56,32.99 v63.99,25 | v63.99,27 63.99,27.99 v65.27,29.27 | v67,33 67,31.19
  Bottom 0.254: v65.11,18 63.35,18 63.17,18.19 55.81,18.19 v55,19 | v55,30 55,32 v56,33 | v63.99,25 v63.99,27 | v65.27,29.27 65.27,31.27 v67,33
N$17
  Top 0.254: C1.2 59.23,37.25 59.37,37.1 59.97,37.1 U$1.6
N$18
  Top 0.254: J3.D+ 72.39,47.1 R1.1
N$19
  Top 0.254: U$1.4 60.51,38.7 67.51,38.7 70.57,41.76 70.57,43.58 R1.2
N$20
  Top 0.254: J3.D- 73.19,47.11 R2.1
N$21  (via drill 0.35)
  Top 0.254: R2.2 73.27,44.34 73.27,43.89 67.38,38 v66,38 | v64.5,39.4 60.41,39.4 U$1.3
  Bottom 0.254: v66,38 65.9,38 v64.5,39.4
N$22  (via drill 0.35)
  Top 0.254: Y1.2 75.92,22.86 C2.2 72.05,25.05 v72,25 | U$1.17 66.31,30.76 66.31,30.16 66.47,30 67,30 v68,29
  Bottom 0.254: v72,25 v68,29
N$23
  Top 0.254: Y1.1 72.89,27.94 C3.1 71.18,27.9 71.18,26.12 68.78,23.72 64.79,23.72 64.63,23.88 64.63,26.92 64.86,27.14 | 64.86,27.14 65,27.29 | 64.86,27.14 65,27.29 | 65,27.29 65,27.65 65.37,28.02 65.89,28.02 65.92,28 66,28 66,29.68 65.51,30.16 65.51,30.76 U$1.16
N$24  (via drill 0.35)  (1 unrouted)
  Top 0.254: 67.64,32.64 v68,33 | IS1.SCL 63.85,16.25 63.18,16.25 63.02,16.09 63.02,16.02 60.81,13.81 59.42,13.81 56.87,11.26 56.87,11 56.87,10.74 57.24,10.37 58.63,10.37 R4.1 58.13,9.45 v57.45,9.45 | v60,6 59,6 v57,8
  Bottom 0.254: v68,33 68,29.89 67.37,29.26 67.37,28.64 76.33,19.68 76.33,15.44 74.26,13.37 67.37,13.37 62,8 v60,6 | v57,8 57,9 v57.45,9.45
N$27  (via drill 0.35)
  Top 0.254: R3.1 61.35,23.42 62.13,22.64 63.47,22.64 63.82,22.99 v63.99,22.99 | v66,23 66,20.5 IS1.RSET
  Bottom 0.254: v63.99,22.99 v65.99,22.99 v66,23
RST  (via drill 0.35)
  Top 0.254: v63,34 63,31.19 U$1.13 62.84,29.96 63.88,29.96 64.25,29.59 64.25,29.06 63.88,28.69 v62.22,28.69 | v64,9 v60.63,12.37 | v61.49,16.98 61.49,18.12 61.77,18.39 61.77,19.72 v63.09,21.04
  Bottom 0.254: v63,34 63.87,34.87 63.87,39.66 64.24,40.03 65.93,40.03 66.63,40.74 66.63,43.94 64.85,45.73 S1.4 | J2.5 64.14,2.72 65.35,3.94 65.35,7.65 v64,9 | v60.63,12.37 60.63,14 | 60.63,14 60.63,14.42 | v63.09,21.04 63.09,27.83 v62.22,28.69 | 60.63,14 60.63,16.12 v61.49,16.98
SCK  (via drill 0.35)
  Top 0.254: U$1.9 58.43,34.43 v57,33 | J2.3 60.27,3.23 58.55,3.23 56,5.78 v56,22
  Bottom 0.254: v57,33 57,23 v56,22
SW1  (via drill 0.35)
  Top 0.254: MX1.G- 10.79,34.65 10.46,34.32 10.46,32.08 12.67,29.88 12.67,27.27 10.79,25.4 MX4.G- 10.79,15.6 10.46,15.27 10.46,13.03 12.67,10.83 12.67,8.22 10.79,6.35 MX7.G- | MX2.G- 29.84,34.65 29.52,34.32 29.52,32.08 31.72,29.88 31.72,27.27 29.84,25.4 MX5.G- 29.84,15.6 29.52,15.27 29.52,13.03 31.72,10.83 31.72,8.22 29.84,6.35 MX8.G- | MX3.G- 48.9,34.65 48.56,34.32 48.56,32.08 50.77,29.88 50.77,27.27 48.9,25.4 MX6.G- 48.9,15.6 48.56,15.27 48.56,13.03 50.77,10.83 50.77,8.22 48.9,6.35 MX9.G- | v57.5,11 58.89,11 59.63,11.74 59.63,12.63 60,13 62,13 63,12 64.13,12 65.31,10.82 65.79,10.82 65.97,11 66,11 66,11.7 IS1.SW1
  Bottom 0.254: MX1.G- 11.88,42.55 12.91,41.52 27.73,41.52 28.76,42.55 MX2.G- 30.93,42.55 33.47,40.01 45.27,40.01 47.81,42.55 MX3.G- | MX9.G- 49.98,4.45 51.01,5.47 51.47,5.47 57,11 v57.5,11
SW2  (via drill 0.35)
  Top 0.254: MX1.R- 5.71,33.38 4.12,31.78 4.12,30.45 5.71,28.85 MX4.R- 5.71,14.33 4.12,12.73 4.12,11.4 5.71,9.8 MX7.R- | MX2.R- 24.77,33.38 23.16,31.78 23.16,30.45 24.77,28.85 MX5.R- 24.77,14.33 23.16,12.73 23.16,11.4 24.77,9.8 MX8.R- | MX3.R- 43.81,33.38 42.22,31.78 42.22,30.45 43.81,28.85 MX6.R- 43.81,14.33 42.22,12.73 42.22,11.4 43.81,9.8 MX9.R- | v59,12 59.23,12.23 59.23,12.8 59.83,13.41 62.17,13.41 62.9,12.68 66.29,12.68 66.46,12.51 66.46,11.84 IS1.SW2
  Bottom 0.254: MX4.R- 6.8,23.5 7.83,22.47 13.76,22.47 14.79,23.5 MX5.R- 25.85,23.5 28.39,20.96 35.82,20.96 38.36,23.5 MX6.R- | MX9.R- 44.9,4.45 45.93,5.47 50.43,5.47 56.59,11.63 58.63,11.63 v59,12
SW3  (via drill 0.35)
  Top 0.254: MX1.B- 13.34,34.65 13.66,34.32 13.66,32.99 13.34,32.66 MX4.B- 13.34,15.6 13.66,15.27 13.66,4.78 MX7.B- | MX2.B- 32.38,34.65 32.72,34.32 32.72,32.99 32.38,32.66 MX5.B- 32.38,15.6 32.72,15.27 32.72,4.78 MX8.B- | MX3.B- 51.44,34.65 51.77,34.32 51.77,32.99 51.44,32.66 MX6.B- 51.44,15.6 51.77,15.27 51.77,4.78 MX9.B- | MX9.B- 54.79,4.45 58.55,0.69 62.69,0.69 63,1 63,1.32 62.92,1.4 62.92,6.95 66.95,10.98 66.95,11.65 IS1.SW3 | v50.6,6.9 50.6,5.28 MX9.B-
  Bottom 0.254: MX7.B- 23.31,4.45 24.34,3.42 30.27,3.42 31.3,4.45 MX8.B- 32.76,4.45 35.3,1.91 39.82,1.91 43.8,5.88 49.58,5.88 v50.6,6.9